# EasyEDA Pro project design-2.eprj, schematic Schematic1_1
Board Name: Board1; Create Date: 2026-03-02; Page Name: P1; Project Name: Deisgn 2; Schematic Name: Schematic1; Update Date: 2026-04-21; Company: EasyEDA.com; Page Size: A4; Version: V1.0
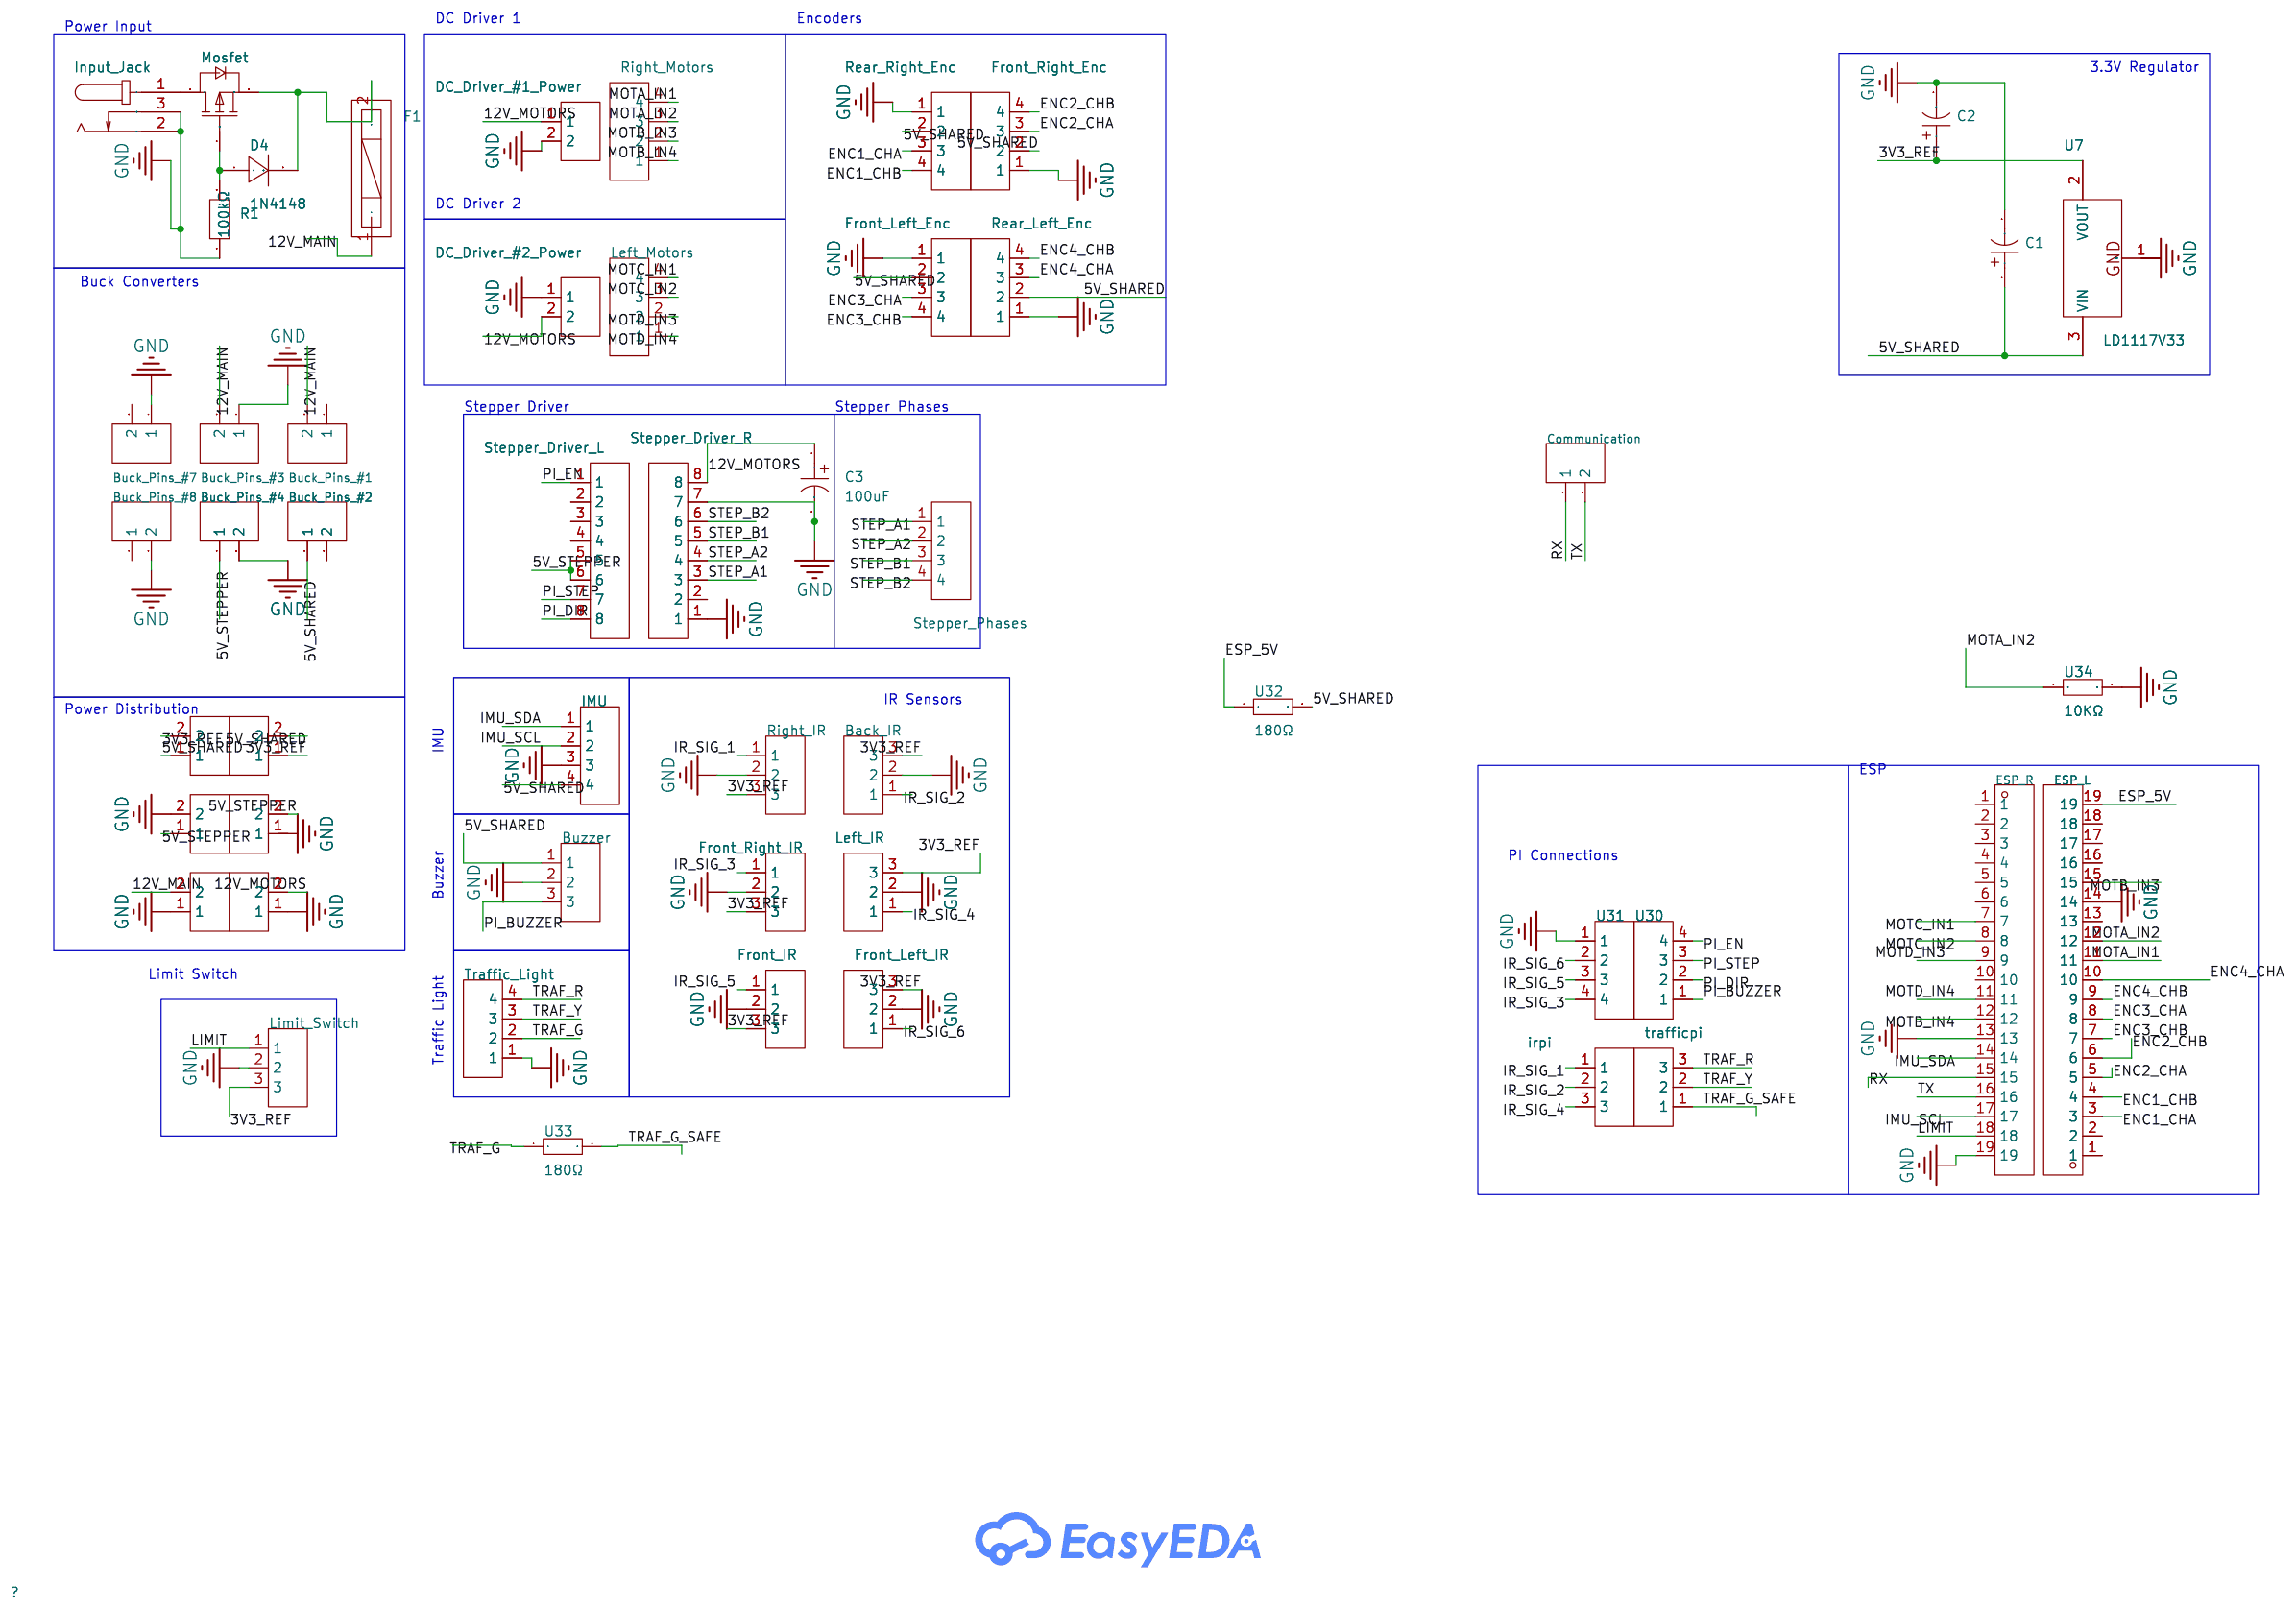
[diagram p1: schematic sheet]

## Parts
5V_SHARED+GND_IN  KF301-2P接线端子  [CONN-TH_XY301V-A-5.0-2P]
5V_SHARED+GND_IN1  KF301-2P接线端子  [CONN-TH_XY301V-A-5.0-2P]
5V_STEPPER+GND  KF301-2P接线端子  [CONN-TH_XY301V-A-5.0-2P]
12V_MAIN+GND  KF301-2P接线端子  [CONN-TH_XY301V-A-5.0-2P]
12V_MOTORS+GND  KF301-2P接线端子  [CONN-TH_XY301V-A-5.0-2P]
Back_IR  XY-B3B-XH-A  [CONN-TH_3P-P2.50_A2501WV2-3P]
Buck_Pins_#1  2.54-1*2P母  [HDR-TH_2P-P2.54-V-F]
Buck_Pins_#2  2.54-1*2P母  [HDR-TH_2P-P2.54-V-F]
Buck_Pins_#3  2.54-1*2P母  [HDR-TH_2P-P2.54-V-F]
Buck_Pins_#4  2.54-1*2P母  [HDR-TH_2P-P2.54-V-F]
Buck_Pins_#7  2.54-1*2P母  [HDR-TH_2P-P2.54-V-F]
Buck_Pins_#8  2.54-1*2P母  [HDR-TH_2P-P2.54-V-F]
Buzzer  XY-B3B-XH-A  [CONN-TH_3P-P2.50_A2501WV2-3P]
C1  10uF  [CAP-TH_BD5.0-P2.00-D0.6-FD]
C2  10uF  [CAP-TH_BD5.0-P2.00-D0.6-FD]
C3  100uF  [CAP-TH_BD6.3-P2.50-D0.6-FD-1]
Communication  2.54-1*2P母  [HDR-TH_2P-P2.54-V-F]
D4  1N4148  [DO-35_BD2.0-L4.0-P8.00-D0.5-FD]
DC_Driver_#1_Power  KF301-2P接线端子  [CONN-TH_XY301V-A-5.0-2P]
DC_Driver_#2_Power  KF301-2P接线端子  [CONN-TH_XY301V-A-5.0-2P]
ESP_L  2.54-1*19P母  [HDR-TH_19P-P2.54-V-F]
ESP_R  2.54-1*19P母  [HDR-TH_19P-P2.54-V-F]
F1  5x20 BLX-A型 保险丝支架 XC-7  [FUSE-TH_L22.6-W9.0]
Front_IR  XY-B3B-XH-A  [CONN-TH_3P-P2.50_A2501WV2-3P]
Front_Left_Enc  B4B-XH-A-G  [CONN-TH_B4B-XH-A-G]
Front_Left_IR  XY-B3B-XH-A  [CONN-TH_3P-P2.50_A2501WV2-3P]
Front_Right_Enc  B4B-XH-A-G  [CONN-TH_B4B-XH-A-G]
Front_Right_IR  XY-B3B-XH-A  [CONN-TH_3P-P2.50_A2501WV2-3P]
IMU  B4B-XH-A-G  [CONN-TH_B4B-XH-A-G]
Input_Jack  DC005  [DC-IN-TH_DC005]
irpi  XY-B3B-XH-A  [CONN-TH_3P-P2.50_A2501WV2-3P]
Left_IR  XY-B3B-XH-A  [CONN-TH_3P-P2.50_A2501WV2-3P]
Left_Motors  B4B-XH-A-G  [CONN-TH_B4B-XH-A-G]
Limit_Switch  XY-B3B-XH-A  [CONN-TH_3P-P2.50_A2501WV2-3P]
Mosfet  IRF4905  [TO-220-3_L9.9-W4.5-P2.54-L-1]
R1  100kΩ  [RES-TH_BD2.4-L6.3-P10.30-D0.6]
Rear_Left_Enc  B4B-XH-A-G  [CONN-TH_B4B-XH-A-G]
Rear_Right_Enc  B4B-XH-A-G  [CONN-TH_B4B-XH-A-G]
Right_IR  XY-B3B-XH-A  [CONN-TH_3P-P2.50_A2501WV2-3P]
Right_Motors  B4B-XH-A-G  [CONN-TH_B4B-XH-A-G]
Stepper_Driver_L  2.54-1*8P母环保  [HDR-TH_8P-P2.54-V-F]
Stepper_Driver_R  2.54-1*8P母环保  [HDR-TH_8P-P2.54-V-F]
Stepper_Phases  PH2.54-1X4P-H25  [HDR-TH_4P-P2.54-V-M]
Stepper_Pi_Power_IN  KF301-2P接线端子  [CONN-TH_XY301V-A-5.0-2P]
Traffic_Light  B4B-XH-A-G  [CONN-TH_B4B-XH-A-G]
trafficpi  XY-B3B-XH-A  [CONN-TH_3P-P2.50_A2501WV2-3P]
U7  LD1117V33  [TO-220-3_L10.0-W4.5-P2.54-L]
U30  B4B-XH-A-G  [CONN-TH_B4B-XH-A-G]
U31  B4B-XH-A-G  [CONN-TH_B4B-XH-A-G]
U32  180Ω  [RES-TH_BD2.2-L6.5-P10.50-D0.6]
U33  180Ω  [RES-TH_BD2.2-L6.5-P10.50-D0.6]
U34  10KΩ  [RES-TH_BD2.2-L6.5-P10.50-D0.6]

## Library data of the parts
5V_SHARED+GND_IN 5V_SHARED+GND_IN1 5V_STEPPER+GND 12V_MAIN+GND 12V_MOTORS+GND DC_Driver_#1_Power DC_Driver_#2_Power Stepper_Pi_Power_IN = KF301-2P接线端子: Supplier Part: C9900016950; Supplier Footprint: CK301-2P; JLCPCB Part Class: Extended Part; Supplier: LCSC
Back_IR Buzzer Front_IR Front_Left_IR Front_Right_IR irpi Left_IR Limit_Switch Right_IR trafficpi = XY-B3B-XH-A: LCSC Part Name: 1x3P 间距:2.54mm 直插; Supplier Part: C51940188; Manufacturer: XYECONN(辛译); Supplier Footprint: 插件,P=2.5mm; JLCPCB Part Class: Extended Part; Datasheet: https://item.szlcsc.com/datasheet/XY-B3B-XH-A/54660520.html; Supplier: LCSC; Pins Structure: 1x3P; Pitch: 2.54mm; Mounting Type: Through Hole; Number of Pins: 3P; Number of Rows: 1; Number of PINs Per Row: 3; Current Rating: 2A; Contact Material: Brass; Contact Plating: Tin; Operating Temperature: -25℃~+85℃; Voltage Rating: 250V; Plastic Material: PA66; Flame Retardant Rating: UL94V-0; Color: White
Buck_Pins_#1-Buck_Pins_#4 Buck_Pins_#7 Buck_Pins_#8 Communication = 2.54-1*2P母: Holes Structure:1x2P Pitch:2.54mm Row Spacing:- Circular Hole / Square Hole:Square Hole Mounting Type:Through Hole Number of Rows:1 Number of Positions:2P Current Rating:3A Voltage Rating (Max):- Holes Direction:Top Insulation Height:- Contact Material:Br; LCSC Part Name: 1x2P 间距:2.54mm 直插; Supplier Part: C49661; Manufacturer: BOOMELE(博穆精密); Supplier Footprint: 插件,P=2.54mm; JLCPCB Part Class: Extended Part; Datasheet: https://item.szlcsc.com/datasheet/2.54-1*2P%25E6%25AF%258D/50669.html; Supplier: LCSC; Holes Structure: 1x2P; Pitch: 2.54mm; Circular Hole / Square Hole: Square Hole; Mounting Type: Through Hole; Number of Rows: 1; Number of Positions: 2P; Current Rating: 3A; Holes Direction: Top; Contact Material: Brass; Operating Temperature: -40℃~+105℃; PIN Length: 3.3mm
C1 C2 = 10uF25V5x11KM: LCSC Part Name: 10uF ±20% 25V; Supplier Part: C49304949; Manufacturer: Econd(米朗电子); Supplier Footprint: 插件,D5xL11mm; JLCPCB Part Class: Extended Part; Datasheet: https://item.szlcsc.com/datasheet/10uF25V5x11KM/51766777.html; Supplier: LCSC; Tolerance: ±20%; Voltage Rating: 25V; Ripple Current: 38mA@120Hz; Pin Spacing: 2mm; Diameter: 5mm; Height - Seated (Max): 11mm; Lifetime: 2000hrs@105℃; Operating Temperature: -40℃~+105℃
C3 = 100UF25VE110GF: LCSC Part Name: 100uF ±20% 25V; Supplier Part: C46867074; Manufacturer: Econd(米朗电子); Supplier Footprint: 插件,D6.3xL11mm; Datasheet: https://item.szlcsc.com/datasheet/100UF25VE110GF/49031939.html; Supplier: LCSC; Tolerance: ±20%; Voltage Rating: 25V; Ripple Current: 550mA@100KHz; Equivalent Series Resistance(ESR): 170mΩ; Pin Spacing: 2.5mm; Diameter: 6.3mm; Height - Seated (Max): 11mm; Lifetime: 3000hrs@105℃; Operating Temperature: -40℃~+105℃
D4 = 1N4148_C14516: LCSC Part Name: 75V 200mA; Supplier Part: C14516; Manufacturer: ST(先科); Supplier Footprint: DO-35; JLCPCB Part Class: Extended Part; Datasheet: https://item.szlcsc.com/datasheet/1N4148/15180.html; Supplier: LCSC; Voltage - Forward(Vf@If): 1V@10mA; Voltage - DC Reverse(Vr): 75V; Current - Rectified: 200mA; Pd - Power Dissipation: 500mW; Reverse Leakage Current (Ir): 5uA@75V; Reverse Recovery Time (trr): 4ns; Non-Repetitive Peak Forward Surge Current: 4A
ESP_L ESP_R = 2.54-1*19P母: Pitch:2.54mm Row Spacing:- Circular Hole / Square Hole:Square Hole Mounting Type:Through Hole Number of Rows:1 Number of Positions:19P Holes Direction:Top Insulation Height:- Contact Material:- Contact Plating:-; LCSC Part Name: 间距:2.54mm 直插; Supplier Part: C319202; Manufacturer: BOOMELE(博穆精密); Supplier Footprint: 插件,P=2.54mm; JLCPCB Part Class: Extended Part; Supplier: LCSC; Pitch: 2.54mm; Circular Hole / Square Hole: Square Hole; Mounting Type: Through Hole; Number of Rows: 1; Number of Positions: 19P; Holes Direction: Top
F1 = 5x20 BLX-A型 保险丝支架 XC-7: LCSC Part Name: 保险丝座 5x20 BLX-A型; Supplier Part: C3131; Manufacturer: xcfuse(旭程); Supplier Footprint: 插件; JLCPCB Part Class: Extended Part; Datasheet: https://item.szlcsc.com/datasheet/5x20%2520BLX-A%25E5%259E%258B%2520%25E4%25BF%259D%25E9%2599%25A9%25E4%25B8%259D%25E6%2594%25AF%25E6%259E%25B6%2520XC-7/3520.html; Supplier: LCSC; Fuseholder Type: Bracket type; Number of Circuits: 1; Voltage Rating: 250V; Current Rating: 6.3A; Fuse Type: Cylindrical; Fuse Diameter (φD): 5.2mm; Fuse Length: 20mm
Front_Left_Enc Front_Right_Enc IMU Left_Motors Rear_Left_Enc Rear_Right_Enc Right_Motors Traffic_Light U30 U31 = B4B-XH-A-G: LCSC Part Name: 1x4P 间距:2.5mm 直插 系列:XH; Supplier Part: C594232; Manufacturer: JST; Supplier Footprint: 插件,P=2.5mm; JLCPCB Part Class: Extended Part; Datasheet: https://atta.szlcsc.com/upload/public/pdf/source/20201120/C594232_DD5B967B853D5C0FE2944642B90E06D1.pdf; Supplier: LCSC; Pins Structure: 1x4P; Pitch: 2.5mm; Mounting Style: Direct Insert; Reference Series: XH; Number of Pins: 4P; Number of Rows: 1; Number of PINs Per Row: 4; Current Rating (Max): 3A; Contact Material: Brass; Contact Plating: Gold; Operating Temperature Range: -25℃~+85℃; Rated Voltage (Max): 250V; Plastic Material: PA66; Flame Retardant Rating: UL94V-0; Supplementary Features: K-leg punch; Colour: White; Z-Height of the Board: 7mm; X-Length of Bottom Edge on Board (Spacing Line): 12.4mm; Y-Width of Bottom Edge on Board: 5.75mm
Input_Jack = DC005: Connector Type:DC Power Jack Mounting Type:Right Angle Inside Contact Diameter:2mm Outside Contact Diameter:6.3mm Current Rating:500mA Voltage Rating (Max):12V Operating Temperature:-30℃~+70℃ Operating Temperature:-30℃~+70℃; LCSC Part Name: DC005-2.0 黑（铁）; Supplier Part: C431533; Manufacturer: SHOU HAN(首韩); Supplier Footprint: 插件; JLCPCB Part Class: Extended Part; Datasheet: https://item.szlcsc.com/datasheet/DC005/427890.html; Supplier: LCSC; Connector Type: DC Power Jack; Mounting Type: Right Angle; Inside Contact Diameter: 2mm; Outside Contact Diameter: 6.3mm; Current Rating: 500mA; Voltage Rating (Max): 12V; Operating Temperature: -30℃~+70℃
Mosfet = IRF4905: Number:1 P-Channel Drain to Source Voltage:60V Current - Continuous Drain(Id):75A RDS(on):9mΩ Pd - Power Dissipation:200W Gate Threshold Voltage (Vgs(th)):2.5V Gate Charge(Qg):150nC@10V Input Capacitance(Ciss):12nF Reverse Transfer Capacitance (Crss@Vds):; LCSC Part Name: 1个P沟道 耐压:60V 电流:75A; Supplier Part: C5203739; Manufacturer: Cmos(广东场效应半导体); Supplier Footprint: TO-220; JLCPCB Part Class: Extended Part; Datasheet: https://item.szlcsc.com/datasheet/IRF4905/5893408.html; Supplier: LCSC; Number: 1 P-Channel; Drain to Source Voltage: 60V; Current - Continuous Drain(Id): 75A; RDS(on): 9mΩ; Pd - Power Dissipation: 200W; Gate Threshold Voltage (Vgs(th)): 2.5V; Gate Charge(Qg): 150nC@10V; Input Capacitance(Ciss): 12nF; Reverse Transfer Capacitance (Crss@Vds): 450pF; Operating Temperature: -35℃~+175℃; Type: P-Channel; Output Capacitance(Coss): 1nF
R1 = RD1/4W10KJT/BA1: LCSC Part Name: 10kΩ ±5% 250mW 碳膜电阻; Supplier Part: C433778; Manufacturer: Tyohm(幸亚电阻); Supplier Footprint: 插件,D2.4xL6.5mm; JLCPCB Part Class: Extended Part; Datasheet: https://item.szlcsc.com/datasheet/RD1%252F4W10KJT%252FBA1/430783.html; Supplier: LCSC; Type: Carbon Film Resistor; Tolerance: ±5%; Power(Watts): 250mW; Temperature Coefficient: 0ppm/℃~+500ppm/℃
Stepper_Driver_L Stepper_Driver_R = 2.54-1*8P母环保: Holes Structure:1x8P Pitch:2.54mm Row Spacing:- Circular Hole / Square Hole:Square Hole Mounting Type:Through Hole Number of Rows:1 Number of Positions:8P Current Rating:3A Holes Direction:Top Insulation Height:8.5mm Contact Material:Brass Contact Plating; LCSC Part Name: 1x8P 间距:2.54mm 直插; Supplier Part: C27438; Manufacturer: BOOMELE(博穆精密); Supplier Footprint: 插件,P=2.54mm; JLCPCB Part Class: Extended Part; Datasheet: https://item.szlcsc.com/datasheet/2.54-1*8P%25E6%25AF%258D%25E7%258E%25AF%25E4%25BF%259D/28187.html; Supplier: LCSC; Holes Structure: 1x8P; Pitch: 2.54mm; Circular Hole / Square Hole: Square Hole; Mounting Type: Through Hole; Number of Rows: 1; Number of Positions: 8P; Current Rating: 3A; Holes Direction: Top; Insulation Height: 8.5mm; Contact Material: Brass; Contact Plating: Gold; Operating Temperature: -55℃~+105℃; PIN Length: 3.2mm
Stepper_Phases = PH2.54-1X4P-H25: Pin Structure:1x4P Pitch:2.54mm Row Spacing:- Circluar Pins/Square Pins:Pin Header Mounting Type:Through Hole Number of Rows:1 Number of Pins:4P Current Rating:3A Voltage Rating (Max):- Length of Mating Pin:6mm Insulation Height:2.5mm Length of End Connec; LCSC Part Name: 1x4P 间距:2.54mm 方针 直插; Supplier Part: C42431808; Manufacturer: JXTCONN(聚兴泰); Supplier Footprint: 插件,P=2.54mm; JLCPCB Part Class: Extended Part; Datasheet: https://item.szlcsc.com/datasheet/PH2.54-1X4P-H25/44458938.html; Supplier: LCSC; Pin Structure: 1x4P; Pitch: 2.54mm; Circluar Pins/Square Pins: Pin Header; Mounting Type: Through Hole; Number of Rows: 1; Number of Pins: 4P; Current Rating: 3A; Length of Mating Pin: 6mm; Insulation Height: 2.5mm; Length of End Connection Pin: 3mm; Contact Material: Brass; Contact Plating: Gold; Operating Temperature: -40℃~+105℃; Color: Black
U7 = LD1117V33: LCSC Part Name: 可调与固定低压降正电压稳压器; Supplier Part: C283467; Manufacturer: ST(意法半导体); Supplier Footprint: TO-220; JLCPCB Part Class: Extended Part; Datasheet: https://atta.szlcsc.com/upload/public/pdf/source/20181022/C283467_00098992BB1D287195B66486CE33A2DD.pdf; Supplier: LCSC; Output Type: Fixed; Maximum Input Voltage: 15V; Output Voltage: 3.3V; Output Current: 800mA; Power Supply Rejection Ratio (PSRR): 75dB@(120Hz); Dropout Voltage: 1.2V@(800mA); standby current: 10mA; Feature: Thermal Protection(TSD)；Overcurrent Protection(OCP); Operating Temperature: 0℃~+125℃; Output Polarity: Positive electrode; Number of Outputs: 1
U32-U34 = RF25CT52A181J: LCSC Part Name: 保险电阻 180Ω ±5% 250mW; Supplier Part: C367442; Manufacturer: KOA; Supplier Footprint: 插件,D2.3xL6.3mm; JLCPCB Part Class: Extended Part; Datasheet: https://item.szlcsc.com/datasheet/RF25CT52A181J/341426.html; Supplier: LCSC; Type: Fuse Resistor; Tolerance: ±5%; Power(Watts): 250mW; Operating Temperature: -45℃~+155℃

## Nets
3V3_REF: 5V_SHARED+GND_IN.1 5V_SHARED+GND_IN1.2 Back_IR.3 C2.1 Front_IR.3 Front_Left_IR.3 Front_Right_IR.3 Left_IR.3 Limit_Switch.3 Right_IR.3 U7.2(VOUT)
5V_SHARED: 5V_SHARED+GND_IN.2 5V_SHARED+GND_IN1.1 Buck_Pins_#2.1 Buzzer.1 C1.1 Front_Left_Enc.2 Front_Right_Enc.2 IMU.4 Rear_Left_Enc.2 Rear_Right_Enc.2 U7.3(VIN) U32.2
5V_STEPPER: 5V_STEPPER+GND.1 Buck_Pins_#4.1 Stepper_Driver_L.5 Stepper_Driver_L.6 Stepper_Pi_Power_IN.2
12V_MAIN: 12V_MAIN+GND.2 Buck_Pins_#1.2 Buck_Pins_#3.2 F1.1
12V_MOTORS: 12V_MOTORS+GND.2 C3.1 DC_Driver_#1_Power.1 DC_Driver_#2_Power.2 Stepper_Driver_R.8
GND: 5V_STEPPER+GND.2 12V_MAIN+GND.1 12V_MOTORS+GND.1 Back_IR.2 Buck_Pins_#3.1 Buck_Pins_#4.2 Buck_Pins_#7.1 Buck_Pins_#8.2 Buzzer.2 C1.2 C2.2 C3.2 DC_Driver_#1_Power.2 DC_Driver_#2_Power.1 ESP_L.14 ESP_R.13 ESP_R.19 Front_IR.2 Front_Left_Enc.1 Front_Left_IR.2 Front_Right_Enc.1 Front_Right_IR.2 IMU.3 Input_Jack.2 Input_Jack.3 Left_IR.2 Limit_Switch.2 R1.1 Rear_Left_Enc.1 Rear_Right_Enc.1 Right_IR.2 Stepper_Driver_R.1 Stepper_Driver_R.7 Stepper_Pi_Power_IN.1 Traffic_Light.1 U7.1(GND) U31.1 U34.2
ENC1_CHA: ESP_L.3 Rear_Right_Enc.3
ENC1_CHB: ESP_L.4 Rear_Right_Enc.4
ENC2_CHA: ESP_L.5 Front_Right_Enc.3
ENC2_CHB: ESP_L.6 Front_Right_Enc.4
ENC3_CHA: ESP_L.8 Front_Left_Enc.3
ENC3_CHB: ESP_L.7 Front_Left_Enc.4
ENC4_CHA: ESP_L.10 Rear_Left_Enc.3
ENC4_CHB: ESP_L.9 Rear_Left_Enc.4
ESP_5V: ESP_L.19 U32.1
IMU_SCL: ESP_R.17 IMU.2
IMU_SDA: ESP_R.14 IMU.1
IR_SIG_1: irpi.1 Right_IR.1
IR_SIG_2: Back_IR.1 irpi.2
IR_SIG_3: Front_Right_IR.1 U31.4
IR_SIG_4: irpi.3 Left_IR.1
IR_SIG_5: Front_IR.1 U31.3
IR_SIG_6: Front_Left_IR.1 U31.2
LIMIT: ESP_R.18 Limit_Switch.1
MOTA_IN1: ESP_L.11 Right_Motors.4
MOTA_IN2: ESP_L.12 Right_Motors.3 U34.1
MOTB_IN3: ESP_L.15 Right_Motors.2
MOTB_IN4: ESP_R.12 Right_Motors.1
MOTC_IN1: ESP_R.7 Left_Motors.4
MOTC_IN2: ESP_R.8 Left_Motors.3
MOTD_IN3: ESP_R.9 Left_Motors.2
MOTD_IN4: ESP_R.11 Left_Motors.1
PI_BUZZER: Buzzer.3 U30.1
PI_DIR: Stepper_Driver_L.8 U30.2
PI_EN: Stepper_Driver_L.1 U30.4
PI_STEP: Stepper_Driver_L.7 U30.3
RX: Communication.1 ESP_R.15
STEP_A1: Stepper_Driver_R.3 Stepper_Phases.1
STEP_A2: Stepper_Driver_R.4 Stepper_Phases.2
STEP_B1: Stepper_Driver_R.5 Stepper_Phases.3
STEP_B2: Stepper_Driver_R.6 Stepper_Phases.4
TRAF_G: Traffic_Light.2 U33.1
TRAF_G_SAFE: trafficpi.1 U33.2
TRAF_R: Traffic_Light.4 trafficpi.3
TRAF_Y: Traffic_Light.3 trafficpi.2
TX: Communication.2 ESP_R.16
Net-(D4-1): D4.1(A) Mosfet.1(G) R1.2
Net-(D4-2): D4.2(C) F1.2 Mosfet.3(S)
Net-(Input_Jack-1): Input_Jack.1 Mosfet.2(D)

Not connected (* = marked no-connect by the designer): Buck_Pins_#1 1; Buck_Pins_#2 2; Buck_Pins_#7 2; Buck_Pins_#8 1; ESP_L 1 2 13 16 17 18; ESP_R 1 2 3 4 5 6 10; Stepper_Driver_L 2 3 4; Stepper_Driver_R 2

## Notes on the sheet
- DC Driver 1
- Encoders
- Power Input
- 3.3V Regulator
- DC Driver 2
- Buck Converters
- Stepper Driver
- Stepper Phases
- Power Distribution
- IR Sensors
- IMU
- ESP
- PI Connections
- Buzzer
- Limit Switch
- Traffic Light
